# Altium project HeroChassisPCB.PrjPcb
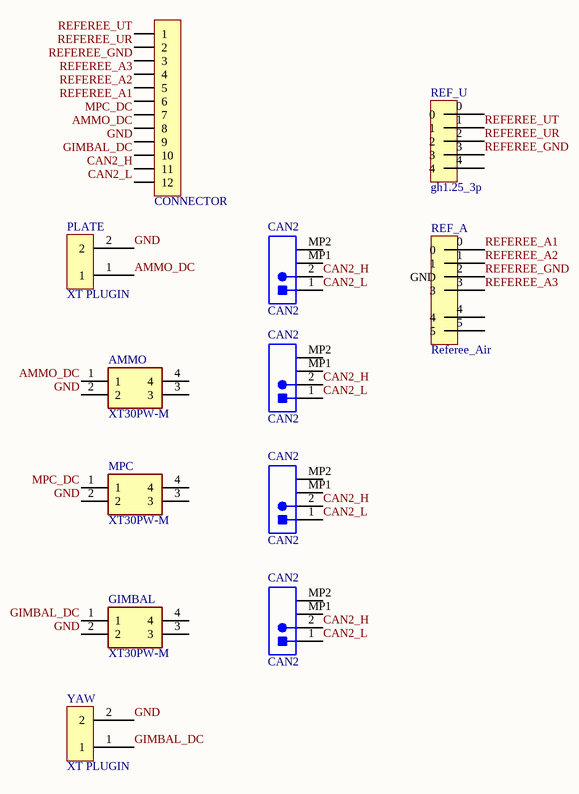
[diagram p0: ChassisPCBSchematic.SchDoc]
1 sheet, 12 parts. Net scope: global (net labels, ports and power ports of the same name join across sheets).
Board file: PCB.PcbDoc

## Sheet ChassisPCBSchematic.SchDoc
size A4

### Parts
(Parts that share a designator on the sheet are numbered #1, #2 ... from top to bottom, then left to right.)
AMMO  XT30PW-M  [XT30PWM]
CAN2#1  CAN2  [JST-BM02B-GHS-TBT_V]
CAN2#2  CAN2  [JST-BM02B-GHS-TBT_V]
CAN2#3  CAN2  [JST-BM02B-GHS-TBT_V]
CAN2#4  CAN2  [JST-BM02B-GHS-TBT_V]
CONNECTOR  HDR-1X12  [HT3.96-LI-12P]  (value not drawn)
GIMBAL  XT30PW-M  [XT30PWM]
MPC  XT30PW-M  [XT30PWM]
PLATE  XT PLUGIN  [XT30-M]
REF_A  Referee_Air  [M8 Connector]
REF_U  gh1.25_3p  [GH1.25-LS-3P]
YAW  XT PLUGIN  [XT30-M]

### Nets
AMMO_DC: AMMO.1 CONNECTOR.8 PLATE.1
CAN2_H: CAN2#1.2 CAN2#2.2 CAN2#3.2 CAN2#4.2 CONNECTOR.11
CAN2_L: CAN2#1.1 CAN2#2.1 CAN2#3.1 CAN2#4.1 CONNECTOR.12
GIMBAL_DC: CONNECTOR.10 GIMBAL.1 YAW.1
GND: AMMO.2 CONNECTOR.9 GIMBAL.2 MPC.2 PLATE.2 YAW.2
MPC_DC: CONNECTOR.7 MPC.1
REFEREE_A1: CONNECTOR.6 REF_A.0
REFEREE_A2: CONNECTOR.5 REF_A.1
REFEREE_A3: CONNECTOR.4 REF_A.3
REFEREE_GND: CONNECTOR.3 REF_A.2(GND) REF_U.3
REFEREE_UR: CONNECTOR.2 REF_U.2
REFEREE_UT: CONNECTOR.1 REF_U.1

Not connected (* = marked no-connect by the designer): AMMO 3 4; CAN2#1 MP1 MP2; CAN2#2 MP1 MP2; CAN2#3 MP1 MP2; CAN2#4 MP1 MP2; GIMBAL 3 4; MPC 3 4; REF_A 4 5; REF_U 0 4

### Library data of the parts
AMMO GIMBAL MPC = XT30PW-M: Connector; Manufacturer_Name: Amass; Datasheet Link: https://www.tme.eu/sl/Document/ce4077e36b79046da520ca73227e15de/XT30PW%20SPEC.pdf; Height: 5mm; Manufacturer_Part_Number: XT30PW-M
CAN2#1-CAN2#4 = CMP-2000-05957-1: Disconnectable Crimp Style Connector, Pitch 1.25 mm, 1 x 2 Position, Height 4.05 mm, -25 to 85 degC, RoHS, Tape and Reel; Manufacturer: JST-Sales-America-Inc.; Connector Type: Header,Shrouded; Number of Positions Loaded: All; Pitch: 0.049"(1.25mm); Number of Positions: 2; Family: RectangularConnectors-Headers,MalePins; Contact Finish: Tin; Contact Type: OuterShroudContact; Number of Rows: 1; Row Spacing: -; Datasheet Version: 05/2016; Fastening Type: LockingRamp; Contact Mating Length: -; Packaging: Digi-Reel®; Manufacturer URL: http://www.jst.com/home2.html; Termination: Solder; Package Description: Disconnectable Crimp Style Connector, Pitch 1.25 mm, 1 x 2 Position, Height 4.05 mm; Features: SolderRetention; Color: Natural; Datasheet URL: http://www.jst-mfg.com/product/pdf/eng/eGH.pdf; Package Reference: BM02B-GHS-TBT; Series: GH; Contact Finish Thickness: -; Mounting Type: SurfaceMount; Mounting Technology: SurfaceMount; Category: Connectors,Interconnects
CONNECTOR = Header 12: 12P接插件; 版权归属: 封装库来自淘宝卖家 ID：黄晶宝石; BOM名称: 12P接插件; 学习资源: https://shop463601444.taobao.com